# EAGLE design telescope_circuit (EAGLE 9.6.2)
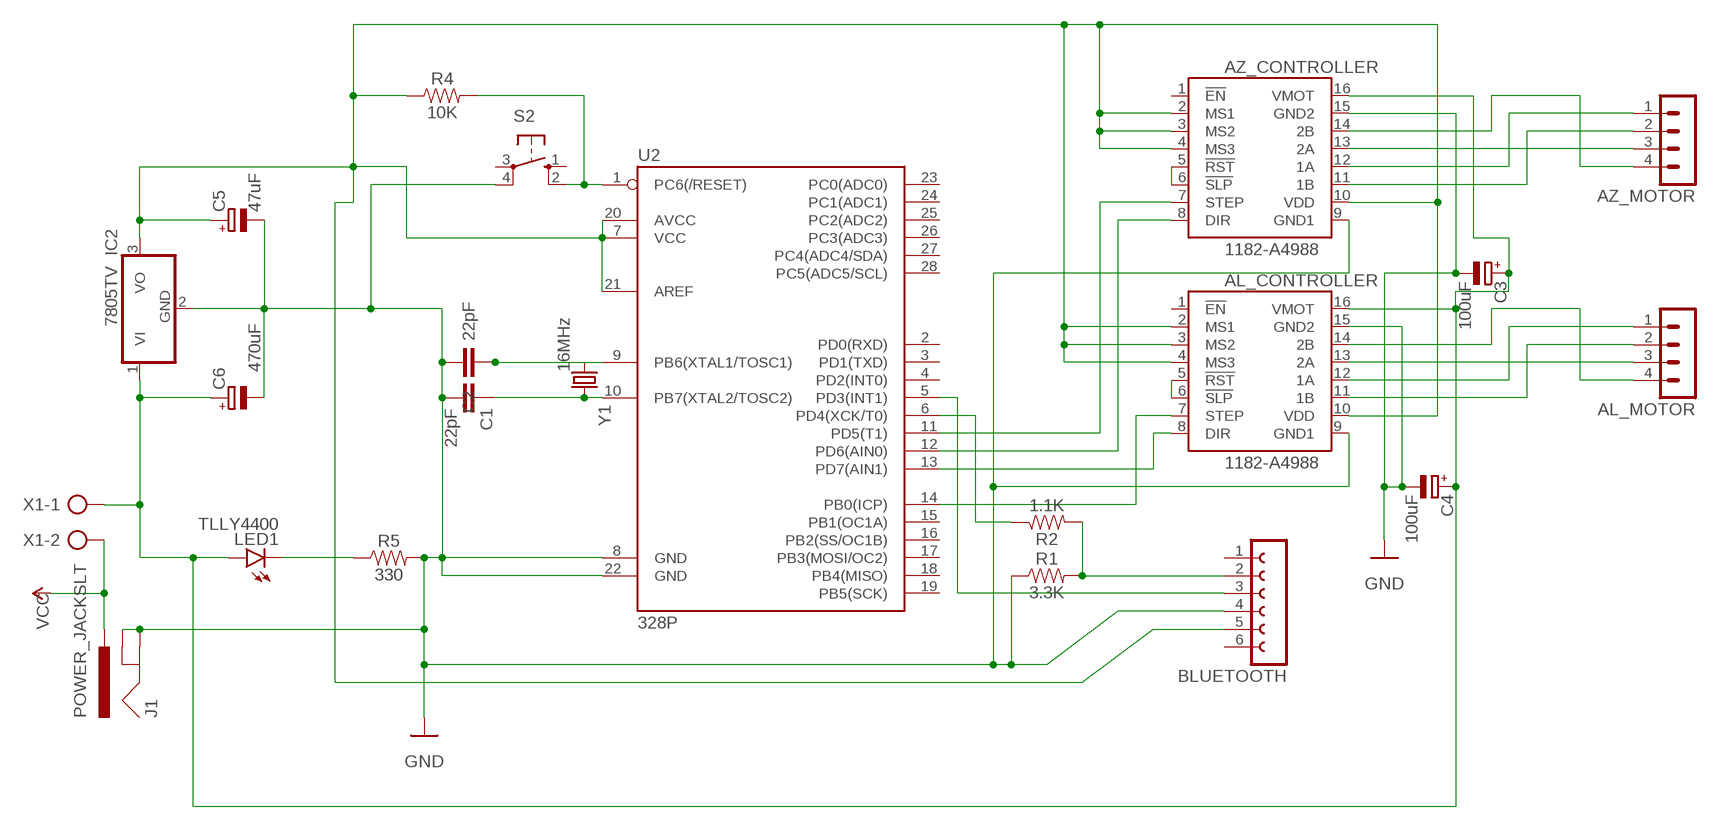
[diagram p0: schematic, sheet 1]

## Parts
AL_CONTROLLER  1182-A4988  [A4988]
AL_MOTOR  MA04-1  [MA04-1]
AZ_CONTROLLER  1182-A4988  [A4988]
AZ_MOTOR  MA04-1  [MA04-1]
BLUETOOTH  FE06W  [FE06W]
C1  22pF  22PF-PTH-2.54MM-200V-5%  [CAP-PTH-2.54]
C2  22pF  22PF-PTH-2.54MM-200V-5%  [CAP-PTH-2.54]
C3  100uF  CPOL-EUE2.5-6  [E2,5-6]
C4  100uF  CPOL-EUE2.5-6  [E2,5-6]
C5  47uF  CPOL-EUE2.5-6  [E2,5-6]
C6  470uF  CPOL-EUE2.5-6  [E2,5-6]
IC2  7805TV  [TO220V]
J1  POWER_JACKSLT  [POWER_JACK_SLOT]
LED1  TLLY4400  [LED3MM]
R1  3.3K  RESISTORAXIAL-0.3  [AXIAL-0.3]
R2  1.1K  RESISTORAXIAL-0.3  [AXIAL-0.3]
R4  10K  RESISTORAXIAL-0.3  [AXIAL-0.3]
R5  330  RESISTORAXIAL-0.3  [AXIAL-0.3]
S2  10-XX  [B3F-10XX]
U2  328P  ATMEGA328P_PDIP  [DIP28]
X1  AK500/2  [AK500/2]
Y1  16MHz  CRYSTAL-16MHZPTH-HC49US  [HC49US]

## Nets
GND: AL_CONTROLLER.9(GND1) AL_CONTROLLER.15(GND2) AZ_CONTROLLER.9(GND1) AZ_CONTROLLER.15(GND2) BLUETOOTH.4 C1.2 C2.2 C3.- C4.- C5.- C6.- IC2.2(GND) J1.GND@1(GNDBREAK) J1.GND@2(GND) R1.P$1 R5.P$2 S2.4(P1) U2.8(GND) U2.22(GND)
N$1: C1.1 U2.10(PB7(XTAL2/TOSC2)) Y1.2
N$2: C2.1 U2.9(PB6(XTAL1/TOSC1)) Y1.1
N$4: AZ_CONTROLLER.7(STEP) U2.11(PD5(T1))
N$5: BLUETOOTH.2 R1.P$2 R2.P$2
N$6: R4.P$2 S2.2(S1) U2.1(PC6(/RESET))
N$7: R2.P$1 U2.6(PD4(XCK/T0))
N$8: AL_CONTROLLER.2(MS1) AL_CONTROLLER.3(MS2) AL_CONTROLLER.4(MS3) AL_CONTROLLER.10(VDD) AZ_CONTROLLER.2(MS1) AZ_CONTROLLER.3(MS2) AZ_CONTROLLER.4(MS3) AZ_CONTROLLER.10(VDD) BLUETOOTH.5 C5.+ IC2.3(VO) R4.P$1 U2.7(VCC) U2.20(AVCC) U2.21(AREF)
N$9: BLUETOOTH.3 U2.5(PD3(INT1))
N$10: AL_CONTROLLER.16(VMOT) AZ_CONTROLLER.16(VMOT) C3.+ C4.+ C6.+ IC2.1(VI) LED1.A X1.1
N$11: AZ_CONTROLLER.8(DIR) U2.12(PD6(AIN0))
N$12: AZ_CONTROLLER.5(!RST) AZ_CONTROLLER.6(!SLP)
N$13: AZ_CONTROLLER.12(1A) AZ_MOTOR.1
N$14: AZ_CONTROLLER.11(1B) AZ_MOTOR.2
N$15: LED1.K(C) R5.P$1
N$16: AZ_CONTROLLER.13(2A) AZ_MOTOR.3
N$17: AZ_CONTROLLER.14(2B) AZ_MOTOR.4
N$18: AL_CONTROLLER.8(DIR) U2.13(PD7(AIN1))
N$19: AL_CONTROLLER.5(!RST) AL_CONTROLLER.6(!SLP)
N$20: AL_CONTROLLER.7(STEP) U2.14(PB0(ICP))
N$21: AL_CONTROLLER.12(1A) AL_MOTOR.1
N$22: AL_CONTROLLER.11(1B) AL_MOTOR.2
N$23: AL_CONTROLLER.13(2A) AL_MOTOR.3
N$24: AL_CONTROLLER.14(2B) AL_MOTOR.4
VCC: J1.PWR X1.2
Unconnected: AL_CONTROLLER.1(!EN) AZ_CONTROLLER.1(!EN) BLUETOOTH.1 BLUETOOTH.6 S2.1(S) S2.3(P) U2.2(PD0(RXD)) U2.3(PD1(TXD)) U2.4(PD2(INT0)) U2.15(PB1(OC1A)) U2.16(PB2(SS/OC1B)) U2.17(PB3(MOSI/OC2)) U2.18(PB4(MISO)) U2.19(PB5(SCK)) U2.23(PC0(ADC0)) U2.24(PC1(ADC1)) U2.25(PC2(ADC2)) U2.26(PC3(ADC3)) U2.27(PC4(ADC4/SDA)) U2.28(PC5(ADC5/SCL))

## Library data of the parts
AL_CONTROLLER AZ_CONTROLLER = pololu-stepper-driver:1182-A4988: A4988 Stepper Motor Driver Carrier #1182 A4988 Stepper Motor Driver Carrier <https://www.pololu.com/product/1182> in Japan, Suzaku Lab. Ltd. <https://suzakugiken.jp/> #1182 A4988ステッピングモータドライバ <https://szc.jp/po1182>
AL_MOTOR AZ_MOTOR = con-lstb:MA04-1: PIN HEADER; OC_FARNELL: unknown; OC_NEWARK: unknown
BLUETOOTH = con-lsta:FE06W: FEMALE HEADER; OC_FARNELL: unknown; OC_NEWARK: unknown
C1 C2 = SparkFun-Capacitors:22PF: 22pF ceramic capacitors A capacitor is a passive two-terminal electrical component used to store electrical energy temporarily in an electric field.; PROD_ID: CAP-09128
C3-C6 = rcl:CPOL-EU: POLARIZED CAPACITOR, European symbol; SPICEPREFIX: C
IC2 = linear:78*: Positive VOLTAGE REGULATOR Source: http://cache.national.com/ds/LM/LM78L05.pdf http://www.fairchildsemi.com/ds/LM/LM7805.pdf
J1 = SparkFun-Connectors:POWER_JACK: Power Jack Connector This is the standard 5.5mm barrel jack for power. The PTH is the most common, proven, reliable, footprint. The Slot footprint only works if the mill layer is transmitted to the PCB fab house so be warned. Here are the connectors we sell at SparkFun: DC Barrel Power Jack/Connector <https://www.sparkfun.com/products/119> (PRT-00119) DC Barrel Power Jack/Connector (SMD) <https://www.sparkfun.com/products/12748> (PRT-12748) DC Barrel Jack Adapter - Breadboard Compatible <https://www.sparkfun.com/products/10811> (PRT-10811) It is used on this SparkFun product (and many, many others): SparkFun RedBoard - Programmed with Arduino <https://www.sparkfun.com/products/12757> (DEV-12757) Also, if you need a mating power supply or connector, please check these out: Wall Adapter Power Supply - 9VDC 650mA <https://www.sparkfun.com/products/298> (TOL-00298) DC Barrel Jack Adapter - Male <https://www.sparkfun.com/products/10287> (PRT-10287); PROD_ID: PRT-00119
LED1 = led:TLLY4400: Low Current (2mA) LED 3 mm Tinted Diffused Package color YELLOW Source: Data sheet <http://www.farnell.com/datasheets/391098.pdf>; MF: VISHAY SEMICONDUCTOR; OC_FARNELL: 1612439
R1 R2 R4 R5 = SparkFun-Resistors:RESISTOR: Generic Resistor Package
S2 = switch-omron:10-XX: OMRON SWITCH; MPN: B3F-1000; OC_FARNELL: 176432; OC_NEWARK: 36M3542
U2 = SparkFun-IC-Microcontroller:ATMEGA328P_PDIP: Atmel 328P Through hole ATMEGA328P uC used in the Arduino 32kb flash, 1k EEPROM, 2k SRAM Datasheet <http://www.sparkfun.com/datasheets/Components/SMD/ATMega328.pdf> SparkFun Products Storefront component: AVR 28 Pin 20MHz 32K 6A/D - ATMega328P <https://www.sparkfun.com/products/9061> (COM-09061) SparkFun Simon Says - Through-Hole Soldering Kit <https://www.sparkfun.com/products/10547> (KIT-10547) SparkFun Learn to Solder - Simon Says <https://www.sparkfun.com/products/13708> (KIT-13708) SparkFun BigTime Watch Kit <https://www.sparkfun.com/products/11734> (KIT-11734) SparkFun ClockIt <https://www.sparkfun.com/products/10930> (KIT-10930) SparkFun Serial Enabled LCD Kit <https://www.sparkfun.com/products/10097> (LCD-10097) SparkFun Simon Tilts - Through Hole Soldering Kit <https://www.sparkfun.com/products/12634> (KIT-12634) SparkFun Frequency Counter Kit <https://www.sparkfun.com/products/10140> (KIT-10140) FabFM Radio Kit <https://www.sparkfun.com/products/11043> (KIT-11043) SparkFun Binary Blaster Kit <https://www.sparkfun.com/products/12037> (KIT-12037) SparkFun Metro-Gnome <https://www.sparkfun.com/products/9236> (KIT-09236) ATmega328 with Arduino Optiboot (Uno) <https://www.sparkfun.com/products/10524> (DEV-10524); PROD_ID: IC-09136
X1 = con-ptr500:AK500/2: CONNECTOR; OC_FARNELL: unknown; OC_NEWARK: unknown
Y1 = SparkFun-Clocks:CRYSTAL-16MHZ: 16MHz Crystal Digikey Example <http://www.digikey.com/product-search/en?keywords=535-9122-1-ND> Frequency: 16MHz Frequency Stability: ±50ppm Frequency Tolerance: ±20ppm Load Capacitance: 18pF SparkFun Products: Pro Micro -5V/16MHz <https://www.sparkfun.com/products/12640> SparkFun Serial Enabled LCD Kit <https://www.sparkfun.com/products/10097>; PROD_ID: XTAL-08181; SF_ID: COM-00536

## Board
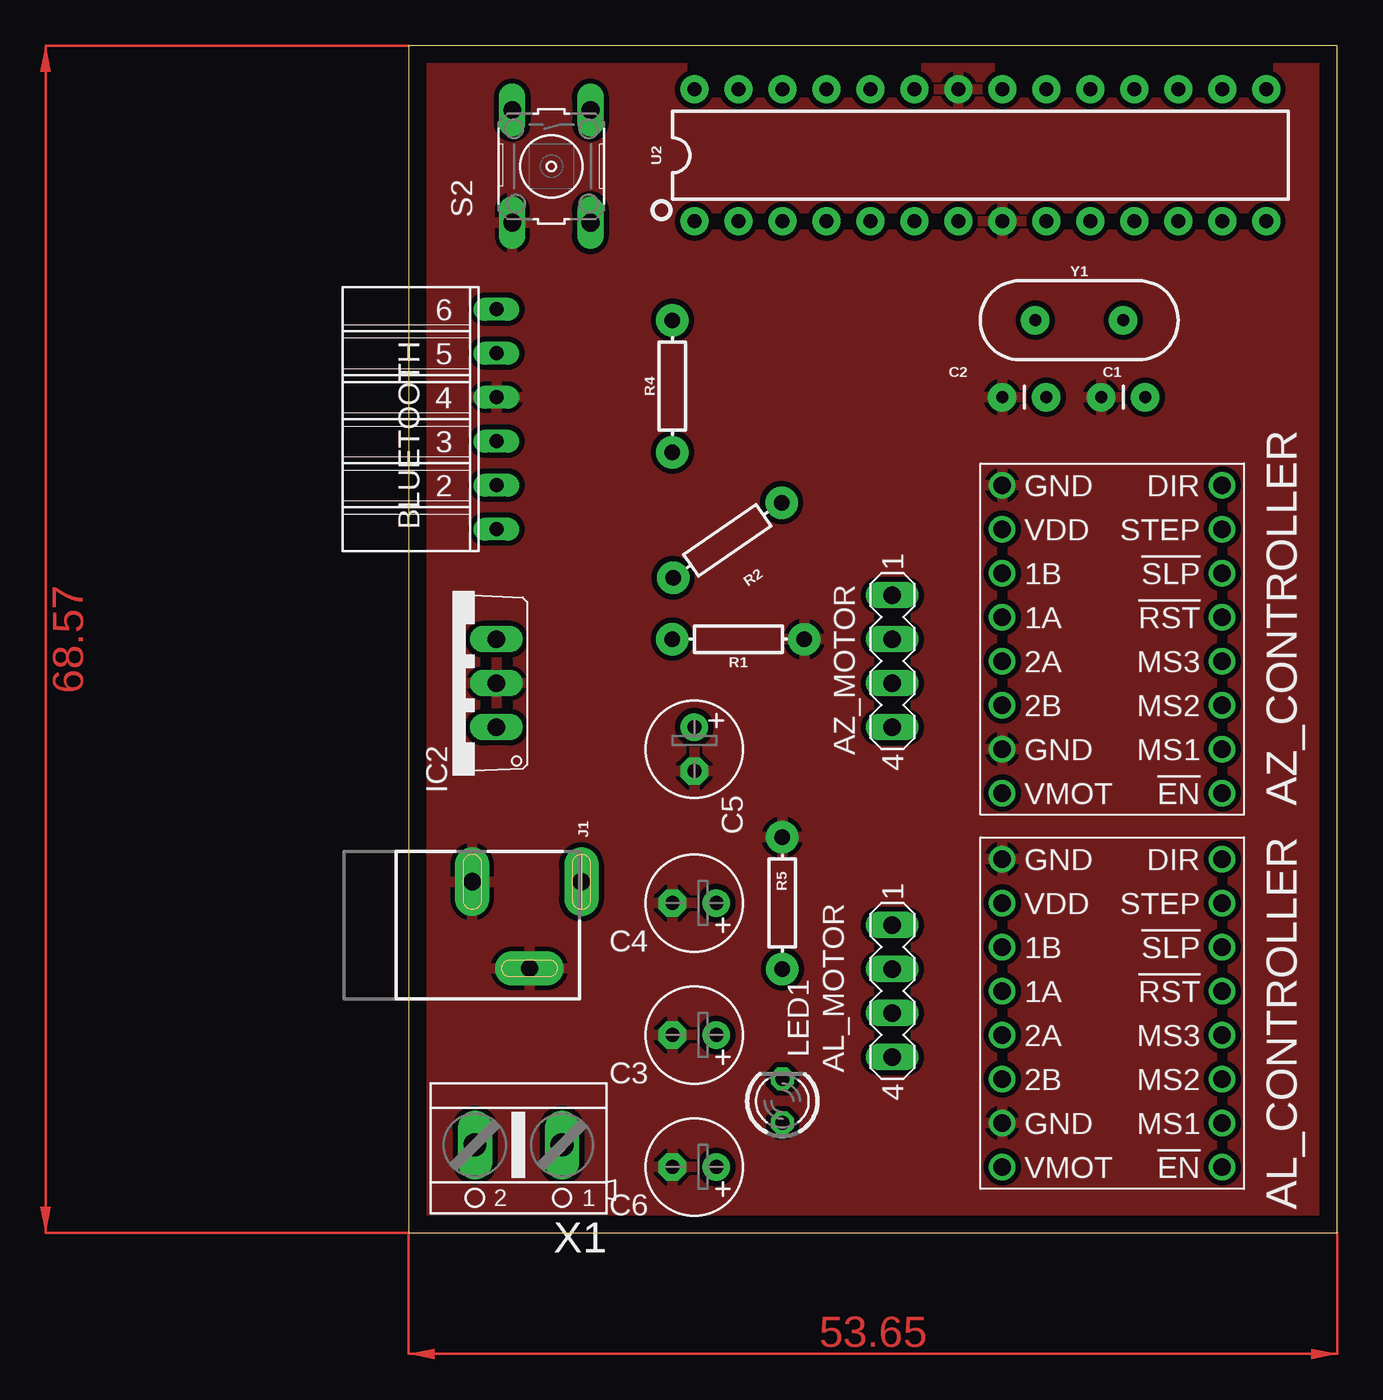
[diagram p1: board, top side]
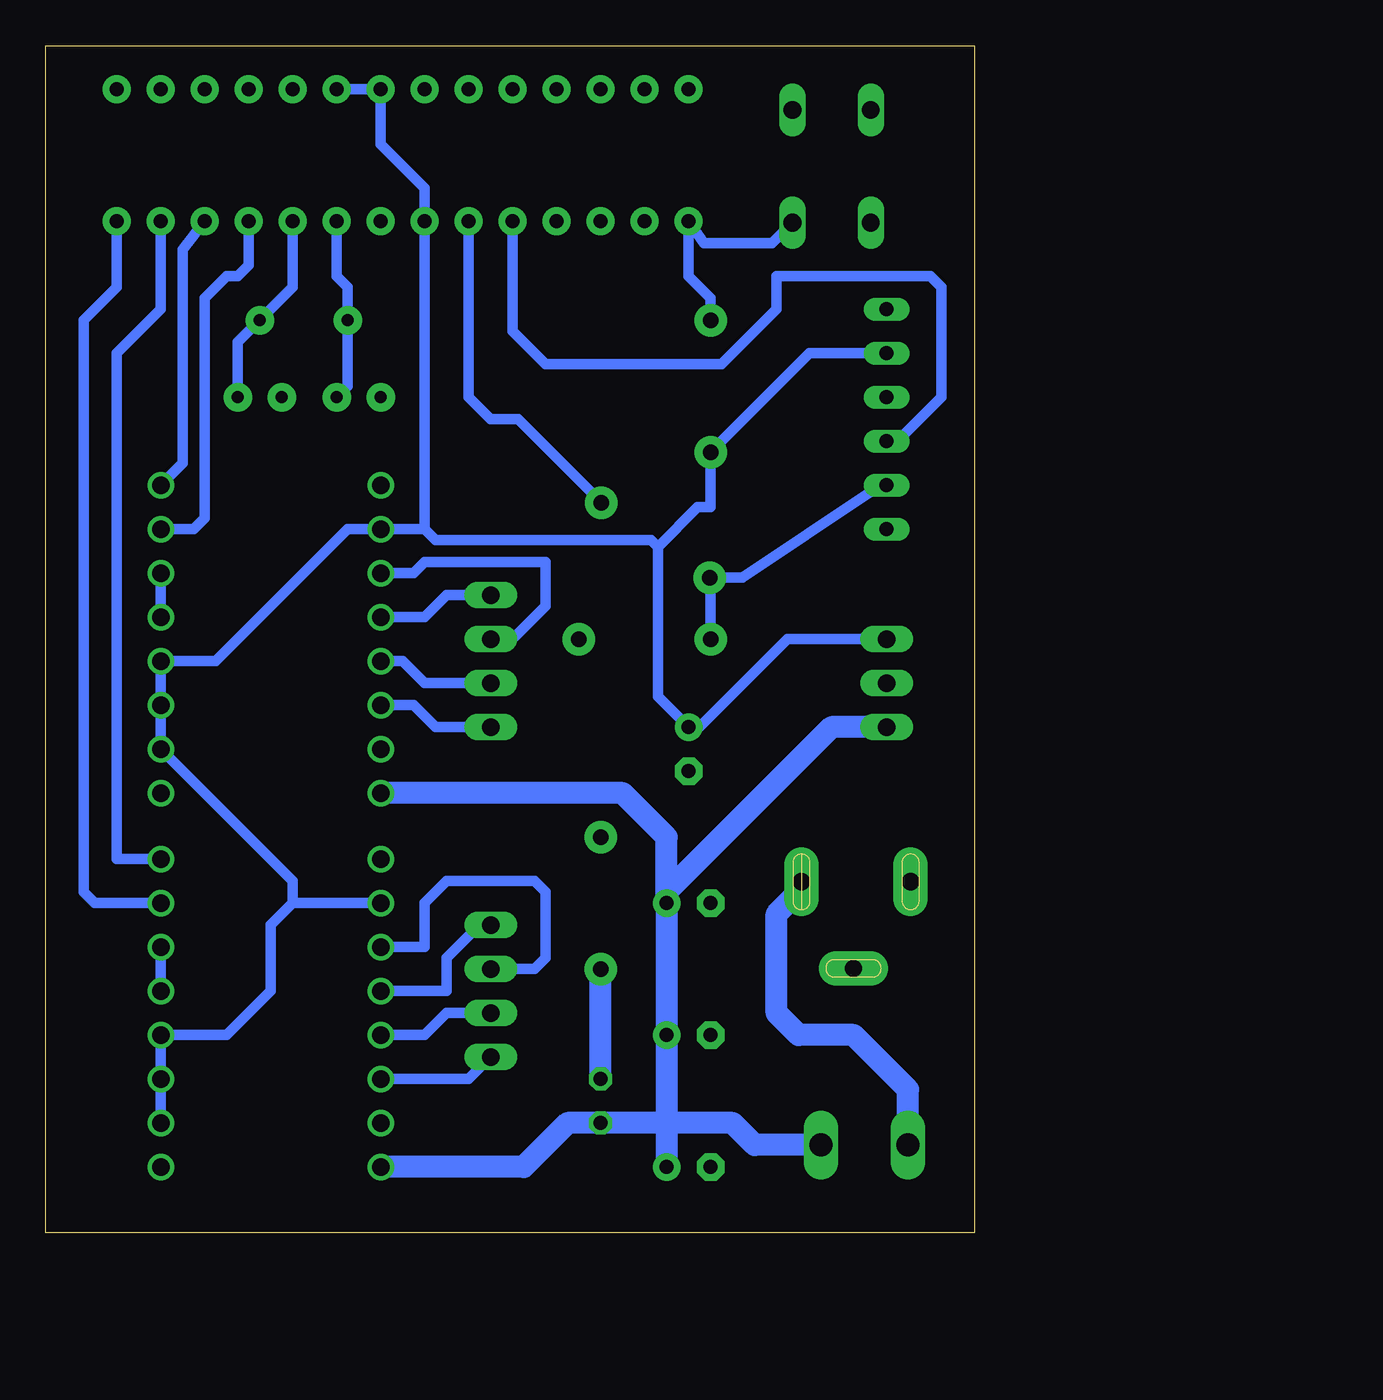
[diagram p2: board, bottom side, seen from below]

Size 53.65 x 68.57 mm. Coordinates in mm from the lower left corner, seen from the top.
Outline: 0,0 53.65,0 53.65,68.57 0,68.57 0,0
Copper layers (1*16): Top 0.035mm / dielectric 1.5mm / Bottom 0.035mm
Design rules "default": minimum track width 6mil, minimum drill 0.35mm, track to track 6mil, track to pad 6mil, pad to pad 6mil, via to via 6mil, smd to smd 6mil, copper to edge 40mil, drill to drill 6mil, minimum pad ring 10mil, minimum via ring 8mil, stop-mask expansion 4mil, vias tented up to drill 0mil, thermal gap 10mil

### Footprints (pad centres in the part's own frame; a part is rotated, then mirrored left to right if it is on the bottom)
A4988 = drill 1.016: 1 -6.35,8.89; 2 -6.35,6.35; 3 -6.35,3.81; 4 -6.35,1.27; 5 -6.35,-1.27; 6 -6.35,-3.81; 7 -6.35,-6.35; 8 -6.35,-8.89; 9 6.35,-8.89; 10 6.35,-6.35; 11 6.35,-3.81; 12 6.35,-1.27; 13 6.35,1.27; 14 6.35,3.81; 15 6.35,6.35; 16 6.35,8.89
MA04-1 = drill 1.016 long: 1 -3.81,0; 2 -1.27,0; 3 1.27,0; 4 3.81,0
FE06W = drill 0.813 long: 1 -6.35,0; 2 -3.81,0; 3 -1.27,0; 4 1.27,0; 5 3.81,0; 6 6.35,0
CAP-PTH-2.54 = drill 0.7 pad 1.651: 1 -1.27,0; 2 1.27,0
E2,5-6 = drill 0.813 pad 1.6: + -1.27,0 | drill 0.813 pad 1.6 octagon: - 1.27,0
TO220V = drill 1.016 long: 1 -2.54,-2.54; 2 0,-2.54; 3 2.54,-2.54
POWER_JACK_SLOT = drill 1 pad 2 long: GND@1 2.58,7.5; GND@2 7.58,10.8; PWR 2.58,13.8
LED3MM = drill 0.813 octagon: A -1.27,0; K 1.27,0
AXIAL-0.3 = drill 0.9 pad 1.88: P$1 -3.81,0; P$2 3.81,0
B3F-10XX = drill 1.016 long: 1 -3.251,2.261; 2 3.251,2.261; 3 -3.251,-2.261; 4 3.251,-2.261
DIP28 = drill 0.813 pad 1.626: 1 -16.51,-3.81; 2 -13.97,-3.81; 3 -11.43,-3.81; 4 -8.89,-3.81; 5 -6.35,-3.81; 6 -3.81,-3.81; 7 -1.27,-3.81; 8 1.27,-3.81; 9 3.81,-3.81; 10 6.35,-3.81; 11 8.89,-3.81; 12 11.43,-3.81; 13 13.97,-3.81; 14 16.51,-3.81; 15 16.51,3.81; 16 13.97,3.81; 17 11.43,3.81; 18 8.89,3.81; 19 6.35,3.81; 20 3.81,3.81; 21 1.27,3.81; 22 -1.27,3.81; 23 -3.81,3.81; 24 -6.35,3.81; 25 -8.89,3.81; 26 -11.43,3.81; 27 -13.97,3.81; 28 -16.51,3.81
AK500/2 = drill 1.321 long: 1 -2.515,0; 2 2.515,0
HC49US = drill 0.7 pad 1.651: 1 -2.54,0; 2 2.54,0

### Placement (x,y rotation side)
AL_CONTROLLER  40.64,12.7 180 top
AL_MOTOR  27.94,13.97 270 top
AZ_CONTROLLER  40.64,34.29 180 top
AZ_MOTOR  27.94,33.02 270 top
BLUETOOTH  5.08,46.99 90 top
C1  41.27,48.26 180 top
C2  35.56,48.26 180 top
C3  16.51,11.43 180 top
C4  16.51,19.05 180 top
C5  16.51,27.94 270 top
C6  16.51,3.81 180 top
IC2  2.54,31.75 90 top
J1  -3.81,22.86 270 top
LED1  21.59,7.62 90 top
R1  19.05,34.29 180 top
R2  18.41,40.01 214.7 top
R4  15.24,48.9 90 top
R5  21.59,19.05 90 top
S2  8.26,61.59 270 top
U2  33.02,62.23 0 top
X1  6.35,5.08 180 top
Y1  38.73,52.7 0 top

### Tracks (layer width: path | path; a pad name or v marks a point on that pad's centre or on a via)
GND
  pour Top (isolate 0.305): -6.35,73.03 -6.35,-2.54 56.52,-2.54 56.52,73.03
N$1
  Bottom 0.61: U2.10 39.37,54.61 Y1.2 42.55,51.44 C1.1
N$2
  Bottom 0.61: U2.9 36.83,55.24 36.2,54.61 Y1.1 36.2,48.9 C2.1
N$4
  Bottom 0.61: AZ_CONTROLLER.7 45.09,40.64 44.45,41.27 44.45,53.98 43.18,55.24 42.55,55.24 41.91,55.88 U2.11
N$5
  Bottom 0.61: R1.P$2 15.24,37.73 R2.P$2 13.4,37.84 6,42.83 5.64,43.18 BLUETOOTH.2
N$6
  Bottom 0.61: S2.2 11.71,57.15 15.62,57.15 U2.1 16.51,55.24 15.24,53.98 R4.P$2
N$7
  Bottom 0.61: R2.P$1 26.36,46.99 27.94,46.99 29.21,48.26 U2.6
N$8
  Bottom 0.61: U2.20 U2.21 34.29,62.87 31.75,60.33 U2.7 31.75,40.64 | 16.26,29.46 C5.+ | AL_CONTROLLER.10 39.37,19.05 | 39.37,19.05 40.64,17.78 40.64,13.97 43.18,11.43 AL_CONTROLLER.4 AL_CONTROLLER.3 AL_CONTROLLER.2 | 18.29,39.62 18.29,30.99 C5.+ | 31.75,40.64 31.11,40.01 18.67,40.01 18.29,39.62 | 31.75,40.64 AZ_CONTROLLER.10 36.2,40.64 43.81,33.02 AZ_CONTROLLER.4 AZ_CONTROLLER.3 AZ_CONTROLLER.2 39.37,20.32 39.37,19.05 | 18.29,39.62 16,41.91 15.24,41.91 R4.P$1 9.53,50.8 BLUETOOTH.5 | C5.+ 15.88,29.21 10.79,34.29 IC2.3
N$9
  Bottom 0.61: U2.5 26.67,52.07 24.77,50.16 14.61,50.16 11.43,53.34 11.43,55.24 2.54,55.24 1.91,54.61 1.91,48.26 4.45,45.72 BLUETOOTH.3
N$10
  Bottom 1.27: 17.78,6.35 13.97,6.35 12.7,5.08 X1.1 | 17.78,6.35 C6.+ C3.+ C4.+ | 17.78,6.35 LED1.A 23.5,6.35 26.04,3.81 AL_CONTROLLER.16 | C4.+ 17.78,22.86 20.32,25.4 AZ_CONTROLLER.16 | IC2.1 8.26,29.21 17.78,19.68 C4.+
N$11
  Bottom 0.61: AZ_CONTROLLER.8 45.72,44.45 45.72,56.77 U2.12
N$12
  Bottom 0.61: AZ_CONTROLLER.5 AZ_CONTROLLER.6
N$13
  Bottom 0.61: AZ_MOTOR.1 30.48,36.83 31.43,35.88 | 31.43,35.88 31.75,35.56 AZ_CONTROLLER.12 | 31.43,35.88
N$14
  Bottom 0.61: AZ_MOTOR.2 26.67,34.29 24.77,36.2 24.77,38.73 31.75,38.73 32.38,38.1 AZ_CONTROLLER.11
N$15
  Bottom 1.27: LED1.K R5.P$1
N$16
  Bottom 0.61: AZ_CONTROLLER.13 33.02,33.02 31.75,31.75 AZ_MOTOR.3
N$17
  Bottom 0.61: AZ_MOTOR.4 31.11,29.21 32.38,30.48 AZ_CONTROLLER.14
N$18
  Bottom 0.61: AL_CONTROLLER.8 49.53,21.59 49.53,50.8 46.99,53.34 U2.13
N$19
  Bottom 0.61: AL_CONTROLLER.5 AL_CONTROLLER.6
N$20
  Bottom 0.61: AL_CONTROLLER.7 50.8,19.05 51.44,19.68 51.44,52.7 49.53,54.61 U2.14
N$21
  Bottom 0.61: AL_MOTOR.1 28.57,17.78 30.48,15.88 30.48,13.97 AL_CONTROLLER.12
N$22
  Bottom 0.61: AL_MOTOR.2 25.4,15.24 24.77,15.88 24.77,19.68 25.4,20.32 30.48,20.32 31.75,19.05 31.75,16.51 AL_CONTROLLER.11
N$23
  Bottom 0.61: AL_MOTOR.3 30.48,12.7 31.75,11.43 AL_CONTROLLER.13
N$24
  Bottom 0.61: AL_MOTOR.4 29.21,8.89 AL_CONTROLLER.14
VCC
  Bottom 1.27: X1.2 3.83,8.28 6.99,11.43 10.16,11.43 11.43,12.7 11.43,18.41 9.99,19.86 J1.PWR
(copper drawn outside any net)
  shapes: Top area x2